# EasyEDA schematic SCH_ORANGE-FCU_2022-09-27.json
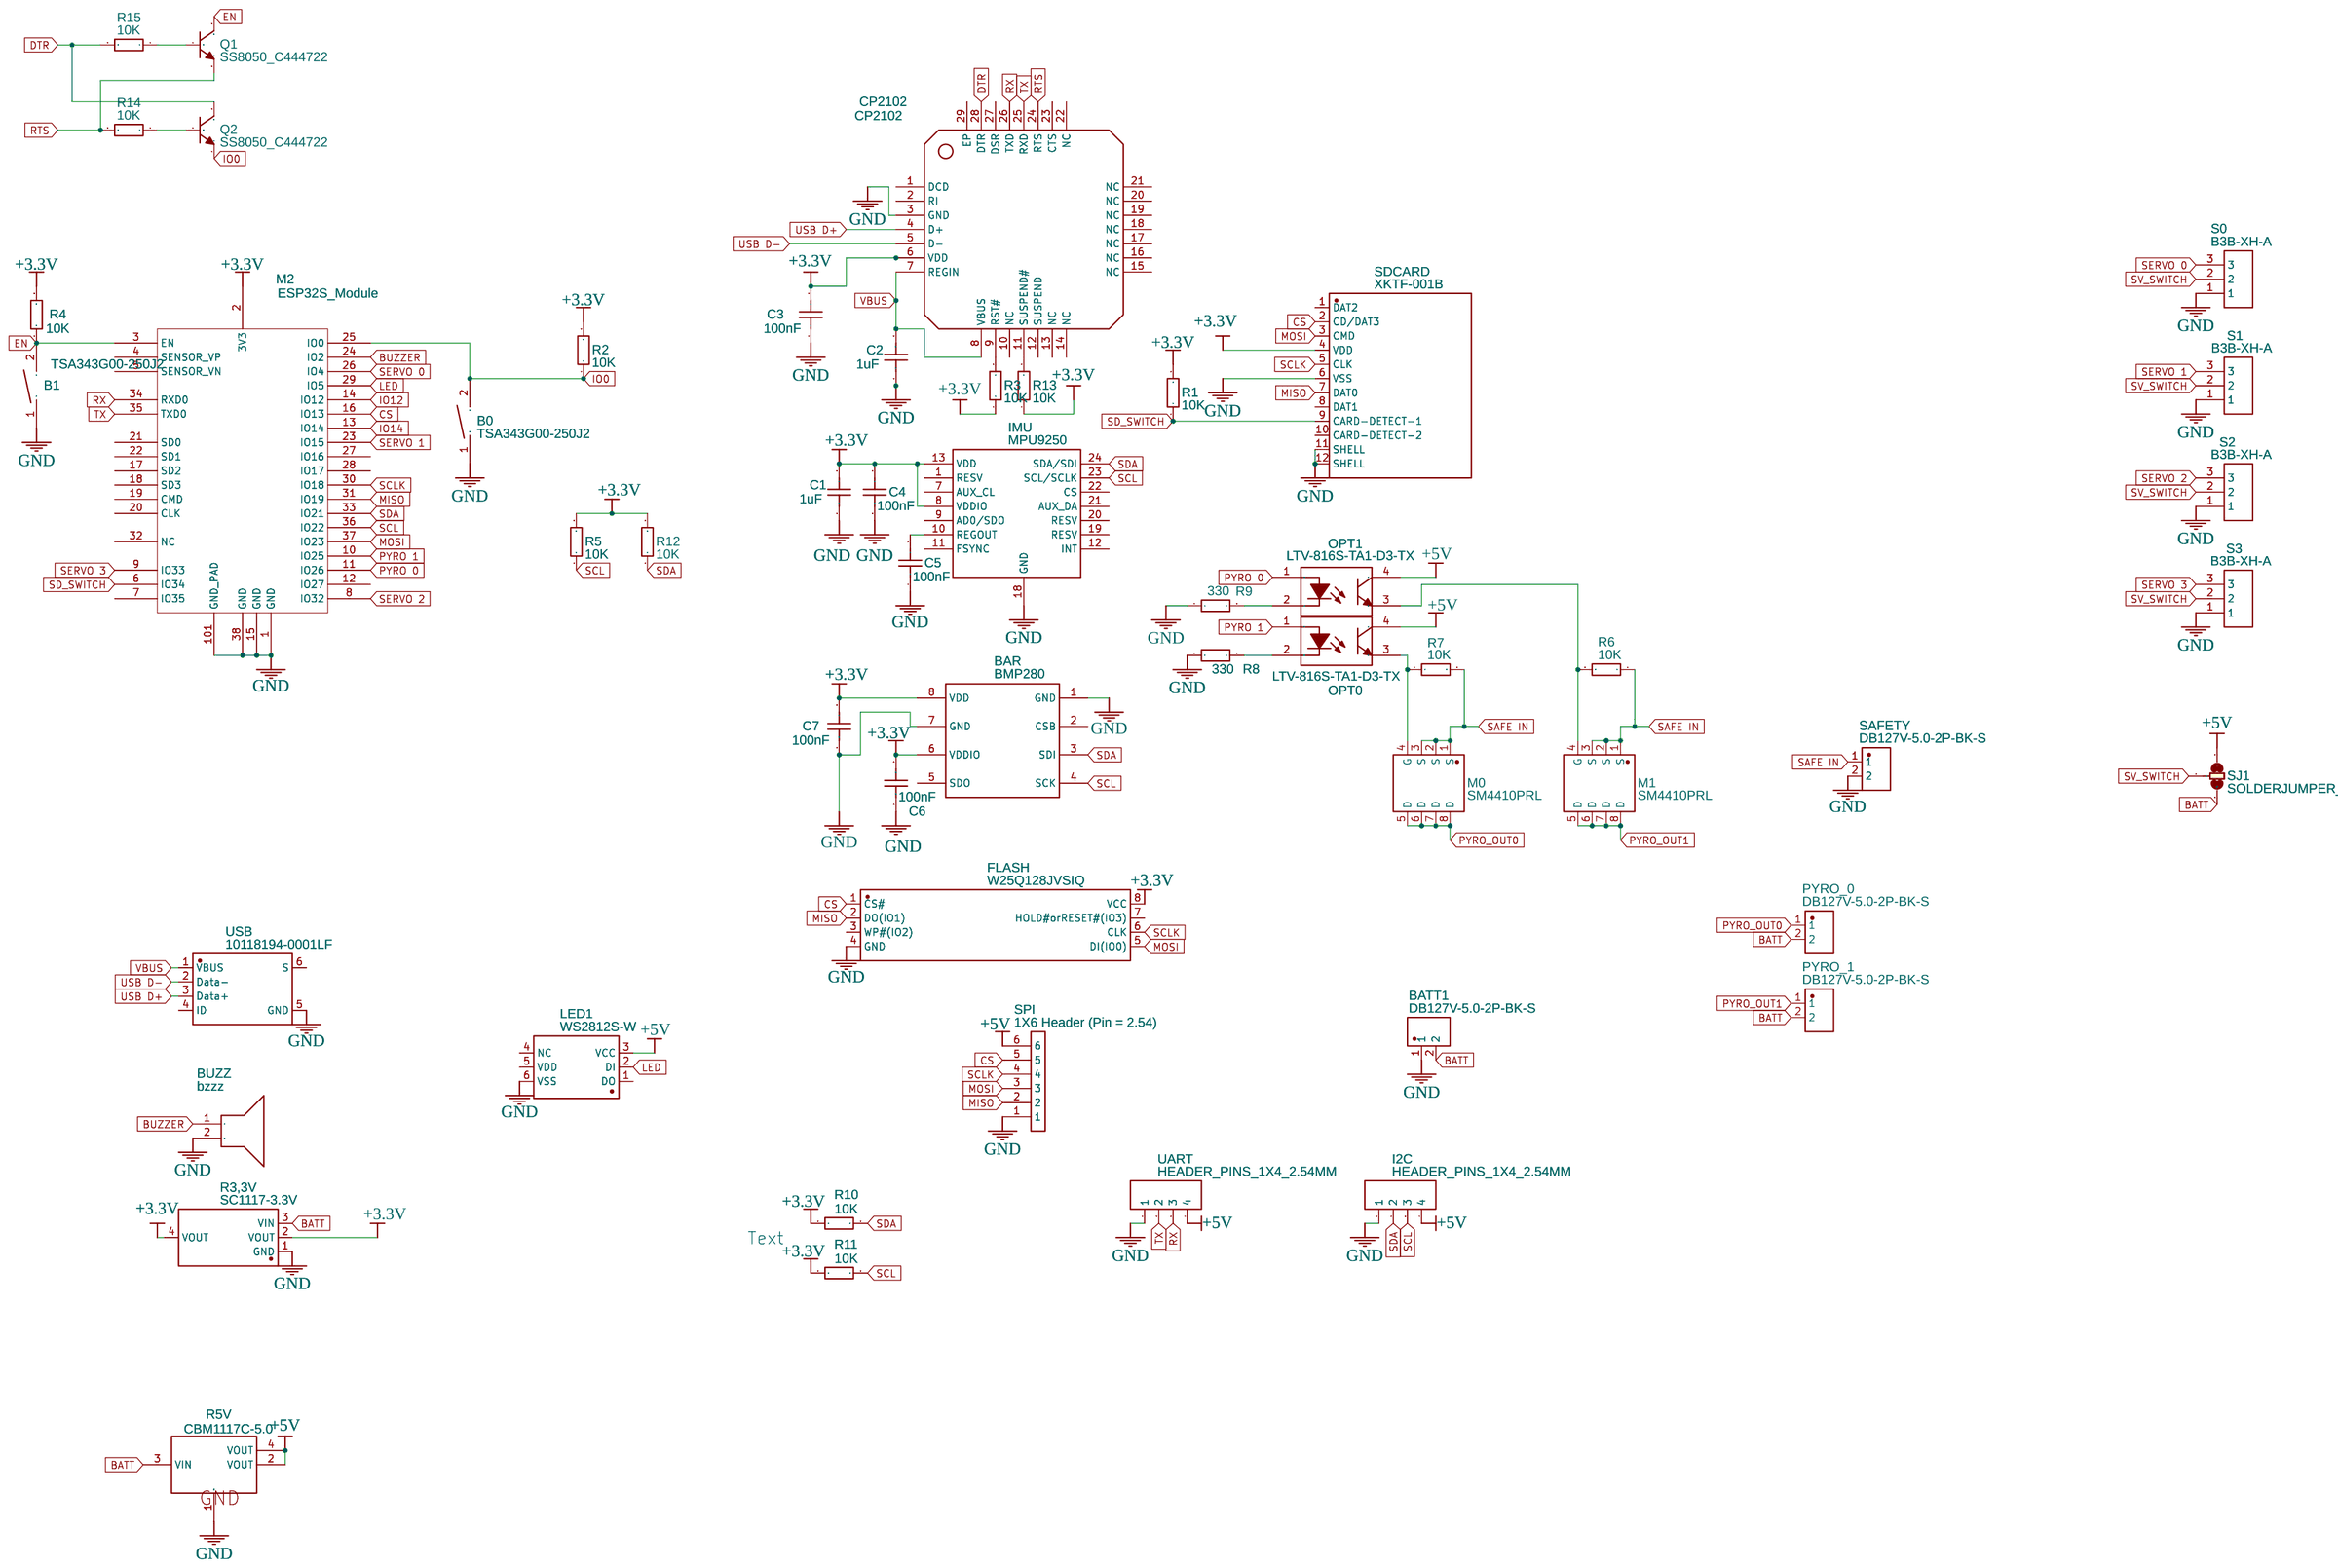
[diagram p0: schematic sheet]

## Parts
B0  TSA343G00-250J2  [SW-SMD_L4.0-W2.9-LS5.0]
B1  TSA343G00-250J2  [SW-SMD_L4.0-W2.9-LS5.0]
BAR  BMP280  [SENSOR-TH_BMP280-BL]
BATT1  DB127V-5.0-2P-BK-S  [CONN-TH_2P-P5.00_DB127V-5.0-2P-BK-S]
BUZZ  bzzz  [BUZ-SMD_FST-9018]
C1  1uF  [C1206]
C2  1uF  [C1206]
C3  100nF  [C1206]
C4  100nF  [C1206]
C5  100nF  [C1206]
C6  100nF  [C1206]
C7  100nF  [C1206]
CP2102  CP2102  [QFN-28_L5.0-W5.0-P0.50-BL-EP]
FLASH  W25Q128JVSIQ  [SOIC-8_L5.3-W5.3-P1.27-LS8.0-BL]
I2C  HEADER_PINS_1X4_2.54MM  [HEADER_PINS_1X4_2.54MM]
IMU  MPU9250  [MPU9250 LAYOUT]
LED1  WS2812S-W  [LED-SMD_6P-L5.0-W5.0-TL]
M0  SM4410PRL  [SOP-8_L4.9-W3.9-P1.27-LS6.0-BL]
M1  SM4410PRL  [SOP-8_L4.9-W3.9-P1.27-LS6.0-BL]
M2  ESP32S_Module  [ESP32S]
OPT0  LTV-816S-TA1-D3-TX  [OPTO-SMD-4_L4.6-W6.5-P2.54-LS10.3-BL]
OPT1  LTV-816S-TA1-D3-TX  [OPTO-SMD-4_L4.6-W6.5-P2.54-LS10.3-BL]
PYRO_0  DB127V-5.0-2P-BK-S  [CONN-TH_2P-P5.00_DB127V-5.0-2P-BK-S]
PYRO_1  DB127V-5.0-2P-BK-S  [CONN-TH_2P-P5.00_DB127V-5.0-2P-BK-S]
Q1  SS8050_C444722  [SOT-23_L2.9-W1.3-P1.90-LS2.4-BR]
Q2  SS8050_C444722  [SOT-23_L2.9-W1.3-P1.90-LS2.4-BR]
R1  10K  [R1206]
R2  10K  [R1206]
R3  10K  [R1206]
R3,3V  SC1117-3.3V  [SOT-223_L6.5-W3.5-P2.30-LS7.0-BR]
R4  10K  [R1206]
R5  10K  [R1206]
R5V  CBM1117C-5.0  [SOT-223-3_L6.5-W3.4-P2.30-LS7.0-BR]
R6  10K  [R1206]
R7  10K  [R1206]
R8  330  [R1206]
R9  330  [R1206]
R10  10K  [R1206]
R11  10K  [R1206]
R12  10K  [R1206]
R13  10K  [R1206]
R14  10K  [R1206]
R15  10K  [R1206]
S0  B3B-XH-A  [CONN-TH_3P-P2.50_B3B-XH-A-LF-SN]
S1  B3B-XH-A  [CONN-TH_3P-P2.50_B3B-XH-A-LF-SN]
S2  B3B-XH-A  [CONN-TH_3P-P2.50_B3B-XH-A-LF-SN]
S3  B3B-XH-A  [CONN-TH_3P-P2.50_B3B-XH-A-LF-SN]
SAFETY  DB127V-5.0-2P-BK-S  [CONN-TH_2P-P5.00_DB127V-5.0-2P-BK-S]
SDCARD  XKTF-001B  [TF-SMD_XKTF-001B]
SJ1  SOLDERJUMPER_2WAY-OLDS  [SJ_3]
SPI  1X6 Header (Pin = 2.54)  [1X6 HEADER (PIN = 2.54)]
UART  HEADER_PINS_1X4_2.54MM  [HEADER_PINS_1X4_2.54MM]
USB  10118194-0001LF  [MICRO-USB-SMD_10118194-0001LF]

## Library data of the parts
B0 B1 = TSA343G00-250J2: Supplier: LCSC; Supplier Part: C354946; Manufacturer: BRIGHT; Contributor: LCSC; JLCPCB Part Class: Extended Part
BAR = BMP280: Supplier: LCSC; Manufacturer: Bosch; Supplier Part: C83291; JLCPCB Part Class: Extended Part
BATT1 PYRO_0 PYRO_1 SAFETY = DB127V-5.0-2P-BK-S: Supplier: LCSC; Supplier Part: C430623; Manufacturer: DIBO; Contributor: LCSC; JLCPCB Part Class: Extended Part
BUZZ = FST-9018: Supplier: LCSC; Supplier Part: C391035; Manufacturer: FUET; Contributor: LCSC; JLCPCB Part Class: Extended Part; Frequency: 4000Hz
C1 C2 = 1206F105Z160CT: Supplier: LCSC; Supplier Part: C408911; Manufacturer: Walsin Tech Corp; Contributor: LCSC
C3-C7 = TCC1206X7R104K101DTS: Supplier: LCSC; Supplier Part: C696845; Manufacturer: CCTC; Contributor: LCSC; JLCPCB Part Class: Extended Part
CP2102 = CP2102-GMR: Supplier: LCSC; Manufacturer: SILICON LABS; LCSC Assembly: Yes; image: //image.lceda.cn/szlcsc/C6568.jpg; Supplier Part: C6568; SMT Type: Basic
FLASH = W25Q128JVSIQ: Supplier: LCSC; Supplier Part: C113767; Manufacturer: Winbond Elec; Contributor: LCSC; JLCPCB Part Class: Extended Part
I2C UART = HEADER_PINS_1X4_2.54MM: Contributor: vblucifer
IMU = MPU9250: Contributor: Cold_play
LED1 = WS2812S-W: Supplier: LCSC; Manufacturer: Worldsemi; Contributor: LCSC; Supplier Part: C114584; JLCPCB Part Class: Extended Part
M0 M1 = SM4410PRL: Supplier: LCSC; Supplier Part: C235535; Manufacturer: SPS; Contributor: LCSC
M2 = ESP32S_Module: Datasheet: https://espressif.com/sites/default/files/documentation/esp_wroom_32_datasheet_en.pdf; Contributor: vikramnain20
OPT0 OPT1 = LTV-816S-TA1-D3-TX: Supplier: LCSC; Manufacturer: LITEON; Supplier Part: C92647; JLCPCB Part Class: Extended Part
Q1 Q2 = SS8050_C444722: Supplier: LCSC; Supplier Part: C444722; Manufacturer: Slkor(SLKORMICRO Elec.); Manufacturer Part: SS8050; Contributor: LCSC; JLCPCB Part Class: Extended Part
R1-R7 R10-R15 = AECR1206F10K0K9: Supplier: LCSC; Supplier Part: C328409; Manufacturer: ResistorToday; Contributor: LCSC; JLCPCB Part Class: Extended Part
R3,3V = SC1117-3.3V: Supplier: LCSC; Manufacturer: FM; Contributor: LCSC; Supplier Part: C173386; JLCPCB Part Class: Extended Part
R5V = CBM1117C-5.0: Supplier: LCSC; Supplier Part: C918918; Manufacturer: Corebai(芯佰微); Contributor: LCSC; JLCPCB Part Class: Extended Part
R8 R9 = RTT06331JTP: Supplier: LCSC; Manufacturer: RALEC; Supplier Part: C104769
S0-S3 = B3B-XH-A(LF)(SN): Supplier: LCSC; Supplier Part: C144394; Manufacturer: JST Sales America; Contributor: LCSC; JLCPCB Part Class: Extended Part
SDCARD = XKTF-001B: Supplier: LCSC; Supplier Part: C381080; Manufacturer: XKB Enterprise; Contributor: LCSC; JLCPCB Part Class: Extended Part
SJ1 = SOLDERJUMPER_2WAY-OLDS: Solder Jumper; Contributor: SparkFun
SPI = 1X6 Header (Pin = 2.54): Manufacturer Part: Male Header 2 pin; Contributor: amir slz
USB = 10118194-0001LF: Supplier: LCSC; Supplier Part: C132563; Manufacturer: Amphenol ICC; Contributor: LCSC; JLCPCB Part Class: Extended Part

## Nets
+3.3V: BAR.6(VDDIO) BAR.8(VDD) C1.2 C3.2 C4.2 C6.2 C7.2 CP2102.6(VDD) FLASH.8(VCC) IMU.8(VDDIO) IMU.13(VDD) M2.2(3V3) R1.2 R2.2 R3.1 R3,3V.2(VOUT) R3,3V.4(VOUT) R4.2 R5.2 R10.1 R11.1 R12.2 R13.1 SDCARD.4(VDD)
+5V: I2C.4 LED1.3(VCC) OPT0.4 OPT1.4 R5V.2(VOUT) R5V.4(VOUT) SJ1.1 SPI.6 UART.4
GND: B0.1 B1.1 BAR.1(GND) BAR.7(GND) BATT1.1 BUZZ.2 C1.1 C2.1 C3.1 C4.1 C5.1 C6.1 C7.1 CP2102.3(GND) FLASH.4(GND) I2C.1 IMU.18(GND) LED1.6(VSS) M2.1(GND) M2.15(GND) M2.38(GND) M2.101(GND_PAD) R3,3V.1(GND) R5V.1(GND) R8.1 R9.1 S0.1 S1.1 S2.1 S3.1 SAFETY.2 SDCARD.6(VSS) SDCARD.11(SHELL) SDCARD.12(SHELL) SPI.1 UART.1 USB.5(GND)
VBUS: C2.2 CP2102.7(REGIN) CP2102.8(VBUS) USB.1(VBUS)
BATT: BATT1.2 PYRO_0.2 PYRO_1.2 R3,3V.3(VIN) R5V.3(VIN) SJ1.3
BUZZER: BUZZ.1 M2.24(IO2)
CS: FLASH.1(CS#) M2.16(IO13) SDCARD.2(CD/DAT3) SPI.5
DTR: CP2102.28(DTR) Q2.3(C) R15.2
EN: B1.2 M2.3(EN) Q1.3(C) R4.1
IO0: B0.2 M2.25(IO0) Q2.2(E) R2.1
IO12: M2.14(IO12)
IO14: M2.13(IO14)
LED: LED1.2(DI) M2.29(IO5)
MISO: FLASH.2(DO(IO1)) M2.31(IO19) SDCARD.7(DAT0) SPI.2
MOSI: FLASH.5(DI(IO0)) M2.37(IO23) SDCARD.3(CMD) SPI.3
PYRO 0: M2.11(IO26) OPT1.1
PYRO 1: M2.10(IO25) OPT0.1
PYRO_OUT0: M0.5(D) M0.6(D) M0.7(D) M0.8(D) PYRO_0.1
PYRO_OUT1: M1.5(D) M1.6(D) M1.7(D) M1.8(D) PYRO_1.1
RTS: CP2102.24(RTS) Q1.2(E) R14.2
RX: CP2102.26(TXD) M2.34(RXD0) UART.3
SAFE IN: M0.1(S) M0.2(S) M0.3(S) M1.1(S) M1.2(S) M1.3(S) R6.1 R7.2 SAFETY.1
SCL: BAR.4(SCK) I2C.3 IMU.23(SCL/SCLK) M2.36(IO22) R5.1 R11.2
SCLK: FLASH.6(CLK) M2.30(IO18) SDCARD.5(CLK) SPI.4
SD_SWITCH: M2.6(IO34) R1.1 SDCARD.9(CARD-DETECT-1)
SDA: BAR.3(SDI) I2C.2 IMU.24(SDA/SDI) M2.33(IO21) R10.2 R12.1
SERVO 0: M2.26(IO4) S0.3
SERVO 1: M2.23(IO15) S1.3
SERVO 2: M2.8(IO32) S2.3
SERVO 3: M2.9(IO33) S3.3
SV_SWITCH: S0.2 S1.2 S2.2 S3.2 SJ1.2
TX: CP2102.25(RXD) M2.35(TXD0) UART.2
USB D+: CP2102.4(D+) USB.3(Data+)
USB D-: CP2102.5(D-) USB.2(Data-)
Net-(C5-2): C5.2 IMU.10(REGOUT)
Net-(CP2102-9): CP2102.9(RST#) R3.2
Net-(CP2102-11): CP2102.11(SUSPEND#) R13.2
Net-(M0-4): M0.4(G) OPT0.3 R7.1
Net-(M1-4): M1.4(G) OPT1.3 R6.2
Net-(OPT0-2): OPT0.2 R8.2
Net-(OPT1-2): OPT1.2 R9.2
Net-(Q1-1): Q1.1(B) R15.1
Net-(Q2-1): Q2.1(B) R14.1

Not connected (* = marked no-connect by the designer): BAR 2(CSB) 5(SDO); CP2102 1(DCD) 2(RI) 10(NC) 12(SUSPEND) 13(NC) 14(NC) 15(NC) 16(NC) 17(NC) 18(NC) 19(NC) 20(NC) 21(NC) 22(NC) 23(CTS) 27(DSR) 29(EP); FLASH 3(WP#(IO2)) 7(HOLD#orRESET#(IO3)); IMU 1(RESV) 7(AUX_CL) 9(AD0/SDO) 11(FSYNC) 12(INT) 19(RESV) 20(RESV) 21(AUX_DA) 22(CS); LED1 1(DO) 4(NC) 5(VDD); M2 4(SENSOR_VP) 5(SENSOR_VN) 7(IO35) 12(IO27) 17(SD2) 18(SD3) 19(CMD) 20(CLK) 21(SD0) 22(SD1) 27(IO16) 28(IO17) 32(NC); SDCARD 1(DAT2) 8(DAT1) 10(CARD-DETECT-2); USB 4(ID) 6(S)

## Notes on the sheet
- Text
